# EAGLE schematic skematik (eagle) tranceiver (EAGLE 7.2.0)
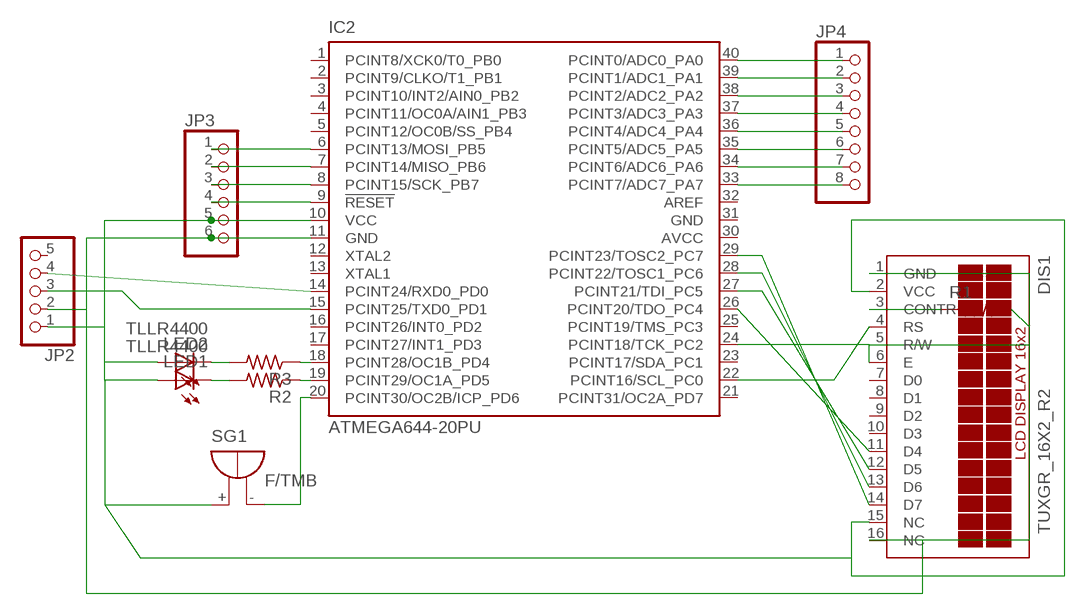
[diagram p0: schematic, sheet 1]

## Parts
DIS1  TUXGR_16X2_R2  [TUXGR_16X2_R2]
IC2  ATMEGA644-20PU  [DIL40]
JP2  PINHD-1X5  [1X05]
JP3  PINHD-1X6  [1X06]
JP4  PINHD-1X8  [1X08]
LED1  TLLR4400  [LED3MM]
LED2  TLLR4400  [LED3MM]
R1  R-US_VMTA55  [VMTA55]
R2  R-US_VMTA55  [VMTA55]
R3  R-US_VMTA55  [VMTA55]
SG1  F/TMB  [F/TMB]

## Nets
N$1: DIS1.1(GND) DIS1.5(R/W) DIS1.16(NC) IC2.11(GND) JP2.2 JP3.6 R1.2
N$2: DIS1.3(CONTR) R1.1
N$3: LED1.K(C) R2.2
N$4: IC2.19(PCINT29/OC1A_PD5) R2.1
N$5: IC2.20(PCINT30/OC2B/ICP_PD6) SG1.-
N$6: DIS1.4(RS) IC2.22(PCINT16/SCL_PC0)
N$7: IC2.9(!RESET) JP3.4
N$8: IC2.8(PCINT15/SCK_PB7) JP3.3
N$9: IC2.7(PCINT14/MISO_PB6) JP3.2
N$10: IC2.6(PCINT13/MOSI_PB5) JP3.1
N$11: DIS1.2(VCC) DIS1.15(NC) IC2.10(VCC) JP2.1 JP3.5 LED1.A LED2.A SG1.+
N$12: IC2.15(PCINT25/TXD0_PD1) JP2.3
N$13: IC2.40(PCINT0/ADC0_PA0) JP4.1
N$14: IC2.14(PCINT24/RXD0_PD0) JP2.4
N$15: IC2.39(PCINT1/ADC1_PA1) JP4.2
N$16: DIS1.6(E) IC2.24(PCINT18/TCK_PC2)
N$17: DIS1.11(D4) IC2.26(PCINT20/TDO_PC4)
N$18: DIS1.12(D5) IC2.27(PCINT21/TDI_PC5)
N$19: DIS1.13(D6) IC2.28(PCINT22/TOSC1_PC6)
N$20: DIS1.14(D7) IC2.29(PCINT23/TOSC2_PC7)
N$21: LED2.K(C) R3.2
N$22: IC2.18(PCINT28/OC1B_PD4) R3.1
N$23: IC2.38(PCINT2/ADC2_PA2) JP4.3
N$24: IC2.37(PCINT3/ADC3_PA3) JP4.4
N$25: IC2.36(PCINT4/ADC4_PA4) JP4.5
N$26: IC2.35(PCINT5/ADC5_PA5) JP4.6
N$27: IC2.34(PCINT6/ADC6_PA6) JP4.7
N$28: IC2.33(PCINT7/ADC7_PA7) JP4.8
Unconnected: DIS1.7(D0) DIS1.8(D1) DIS1.9(D2) DIS1.10(D3) IC2.1(PCINT8/XCK0/T0_PB0) IC2.2(PCINT9/CLKO/T1_PB1) IC2.3(PCINT10/INT2/AIN0_PB2) IC2.4(PCINT11/OC0A/AIN1_PB3) IC2.5(PCINT12/OC0B/SS_PB4) IC2.12(XTAL2) IC2.13(XTAL1) IC2.16(PCINT26/INT0_PD2) IC2.17(PCINT27/INT1_PD3) IC2.21(PCINT31/OC2A_PD7) IC2.23(PCINT17/SDA_PC1) IC2.25(PCINT19/TMS_PC3) IC2.32(AREF) JP2.5

## Power pins joined to a net without a drawn wire
AVCC: IC2.30(AVCC)
GND: IC2.31(GND)

## Library data of the parts
DIS1 = display-lcd:TUXGR_16X2_R2: Tuxgraphics LCD display 16x2 characters reflective, without background light Source: tuxgr_12x2_r2.pdf; OC_FARNELL: unknown; OC_NEWARK: unknown
IC2 = atmel:ATMEGA644-*PU: 8-bit Microcontroller with 64K Bytes In-System Programmable Flash Auto generated by make-symbol-device-package-bsdl.ulp Rev. 34 Source: http://www.atmel.com/dyn/resources/prod_documents/doc2593.pdf; MPN: ATMEGA644-20PU; OC_FARNELL: 1288340; OC_NEWARK: 23M5060
JP2 = pinhead:PINHD-1X5: PIN HEADER
JP3 = pinhead:PINHD-1X6: PIN HEADER
JP4 = pinhead:PINHD-1X8: PIN HEADER
LED1 LED2 = led:TLLR4400: Low Current (2mA) LED 3 mm Tinted Diffused Package color RED Source: Data sheet <http://www.farnell.com/datasheets/391100.pdf>; MF: VISHAY SEMICONDUCTOR; OC_FARNELL: 1612437
R1-R3 = resistor:R-US_: RESISTOR, American symbol
SG1 = buzzer:F/TMB: BUZZER Source: Buerklin; OC_FARNELL: unknown; OC_NEWARK: unknown